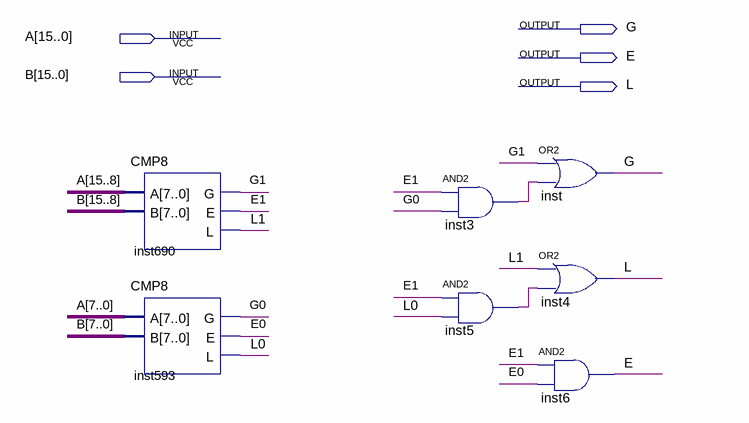
[diagram p0: schematic sheet]
// Quartus schematic CMP16.bdf as structural Verilog: 7 symbols, 5 pins
module CMP16 (
  input  [15:0] A,
  input  [15:0] B,
  output G,
  output E,
  output L
);

  wire E0, E1, G0, G1, inst3_out, inst5_out, L0, L1;

  CMP8 inst690 (.A(A[15:8]), .B(B[15:8]), .G(G1), .E(E1), .L(L1));
  CMP8 inst593 (.A(A[7:0]), .B(B[7:0]), .G(G0), .E(E0), .L(L0));
  and inst3 (inst3_out, E1, G0);
  and inst5 (inst5_out, E1, L0);
  or inst (G, G1, inst3_out);
  or inst4 (L, L1, inst5_out);
  and inst6 (E, E1, E0);
endmodule
